# EAGLE design photoduino.shield.v.1.0 (EAGLE 6.1)
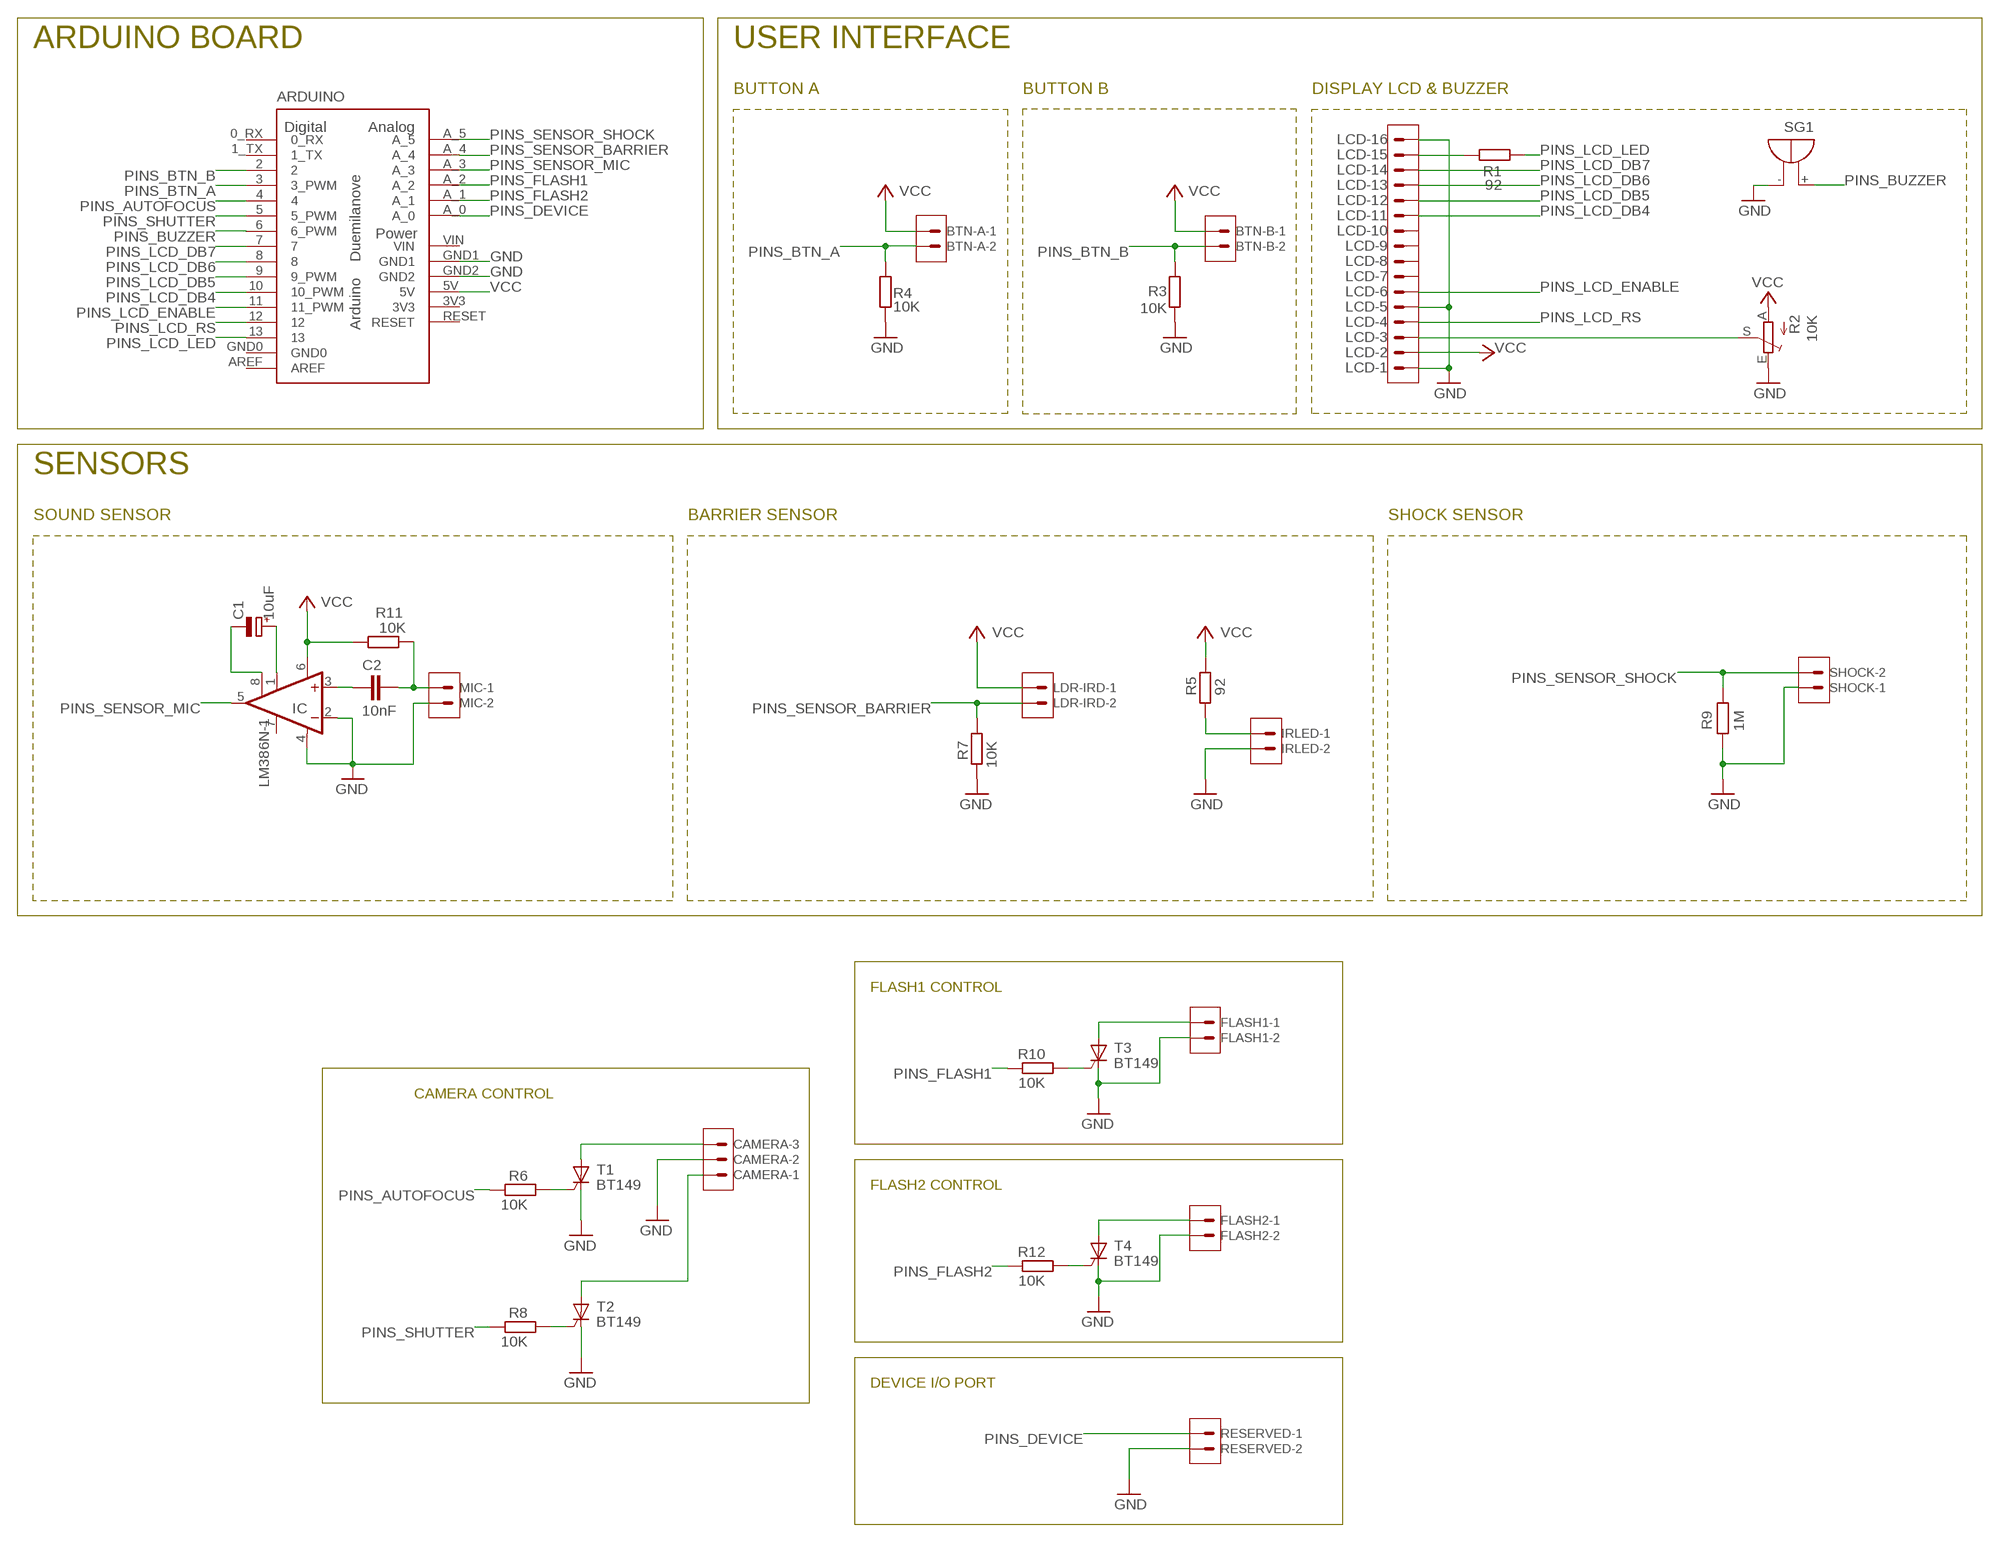
[diagram p0: schematic, sheet 1]

## Parts
ARDUINO  ARDUINO-USBNO-OUTLINE-NO-TEXT-OCTAGONAL  [NO-OUTLINE-OCTAGONAL-NOTEXT]
BTN-A  22-27-2021-02  [6410-02]
BTN-B  22-27-2021-02  [6410-02]
C1  10uF  CPOL-EUE2.5-6  [E2,5-6]
C2  10nF  C-EU050-025X075  [C050-025X075]
CAMERA  22-27-2031-03  [6410-03]
FLASH1  22-27-2021-02  [6410-02]
FLASH2  22-27-2021-02  [6410-02]
IC  LM386N-1  [DIL08]
IRLED  22-27-2021-02  [6410-02]
LCD  HD44780  ML16E  [ML16]
LDR-IRD  22-27-2021-02  [6410-02]
MIC  22-27-2021-02  [6410-02]
R1  92  R-EU_0207/10  [0207/10]
R2  10K  TRIM_EU-RJ9W  [RJ9W]
R3  10K  R-EU_0207/7  [0207/7]
R4  10K  R-EU_0207/7  [0207/7]
R5  92  R-EU_0207/7  [0207/7]
R6  10K  R-EU_0309/V  [0309V]
R7  10K  R-EU_0207/7  [0207/7]
R8  10K  R-EU_0309/V  [0309V]
R9  1M  R-EU_0309/V  [0309V]
R10  10K  R-EU_0309/V  [0309V]
R11  10K  R-EU_0207/7  [0207/7]
R12  10K  R-EU_0309/V  [0309V]
RESERVED  22-27-2021-02  [6410-02]
SG1  F/TMB  [F/TMB]
SHOCK  22-27-2021-02  [6410-02]
T1  BT149  [TO92-4]
T2  BT149  [TO92-4]
T3  BT149  [TO92-4]
T4  BT149  [TO92-4]

## Nets
GND: ARDUINO.GND1 ARDUINO.GND2 CAMERA.2 FLASH1.2 FLASH2.2 IC.2(-IN) IC.4(GND) IRLED.2 LCD.1 LCD.5 LCD.16 MIC.2 R2.E R3.2 R4.1 R7.2 R9.1 RESERVED.2 SG1.- SHOCK.1 T1.C T2.C T3.C T4.C
LCD_CONTRAST: LCD.3 R2.S
N$12: C2.1 IC.3(+IN)
N$16: C2.2 MIC.1 R11.1
N$17: IRLED.1 R5.1
N$18: R10.1 T3.G
N$19: R12.1 T4.G
N$21: CAMERA.3 T1.A
N$23: R6.1 T1.G
N$25: R8.1 T2.G
N$27: C1.+ IC.1(GAIN)
N$29: FLASH2.1 T4.A
N$30: FLASH1.1 T3.A
N$31: C1.- IC.8(GAIN)
N$32: LCD.15 R1.2
PINS_AUTOFOCUS: ARDUINO.4 R6.2
PINS_BTN_A: ARDUINO.3(3_PWM) BTN-A.2 R4.2
PINS_BTN_B: ARDUINO.2 BTN-B.2 R3.1
PINS_BUZZER: ARDUINO.6(6_PWM) SG1.+
PINS_DEVICE: ARDUINO.A_0 RESERVED.1
PINS_FLASH1: ARDUINO.A_2 R10.2
PINS_FLASH2: ARDUINO.A_1 R12.2
PINS_LCD_DB4: ARDUINO.10(10_PWM) LCD.11
PINS_LCD_DB5: ARDUINO.9(9_PWM) LCD.12
PINS_LCD_DB6: ARDUINO.8 LCD.13
PINS_LCD_DB7: ARDUINO.7 LCD.14
PINS_LCD_ENABLE: ARDUINO.11(11_PWM) LCD.6
PINS_LCD_LED: ARDUINO.13 R1.1
PINS_LCD_RS: ARDUINO.12 LCD.4
PINS_SENSOR_BARRIER: ARDUINO.A_4 LDR-IRD.2 R7.1
PINS_SENSOR_MIC: ARDUINO.A_3 IC.5(OUT)
PINS_SENSOR_SHOCK: ARDUINO.A_5 R9.2 SHOCK.2
PINS_SHUTTER: ARDUINO.5(5_PWM) R8.2
SHUTTER: CAMERA.1 T2.A
VCC: ARDUINO.5V BTN-A.1 BTN-B.1 IC.6(VS) LCD.2 LDR-IRD.1 R2.A R5.2 R11.2
Unconnected: ARDUINO.0_RX ARDUINO.1_TX ARDUINO.AREF ARDUINO.GND0 ARDUINO.RESET IC.7(BYPASS) LCD.7 LCD.8 LCD.9 LCD.10

## Notes on the sheet
- ARDUINO BOARD | USER INTERFACE
- BUTTON A | BUTTON B | DISPLAY LCD & BUZZER
- SENSORS
- SOUND SENSOR | BARRIER SENSOR | SHOCK SENSOR
- FLASH1 CONTROL
- CAMERA CONTROL
- FLASH2 CONTROL
- DEVICE I/O PORT

## Power pins joined to a net without a drawn wire
3V3: ARDUINO.3V3
VIN: ARDUINO.VIN

## Library data of the parts
ARDUINO = Arduino-Various:ARDUINO-USB: The Ardiuno Duemilanove Pinouts layoutet as a Bare Shield. v0.5 Also for Arduino Diecimila. This is designed as a Part and has no Outline in the Dimension Layer. The Outline, when present, is drawed at the tPlace / bPlace Layer. Library by Stephanie Lange, http://www.k-ita.de/~sl/
BTN-A BTN-B FLASH1 FLASH2 IRLED LDR-IRD MIC RESERVED SHOCK = con-molex:22-?-02: CONNECTOR wire to board 2.54 mm (.1 inch) pitch header
C1 = resistor:CPOL-EU: POLARIZED CAPACITOR, European symbol
C2 = resistor:C-EU: CAPACITOR, European symbol
CAMERA = con-molex:22-?-03: CONNECTOR wire to board 2.54 mm (.1 inch) pitch header
IC = linear:LM386?-*: Low Voltage Audio Power Amplifier Source: http://cache.national.com/ds/LM/LM386.pdf
LCD = con-ml:ML16E: HARTING
R1 R3-R12 = resistor:R-EU_: RESISTOR, European symbol
R2 = pot:TRIM_EU-: POTENTIOMETER
SG1 = buzzer:F/TMB: BUZZER Source: Buerklin
T1-T4 = triac:BT149: THYRISTOR

## Board
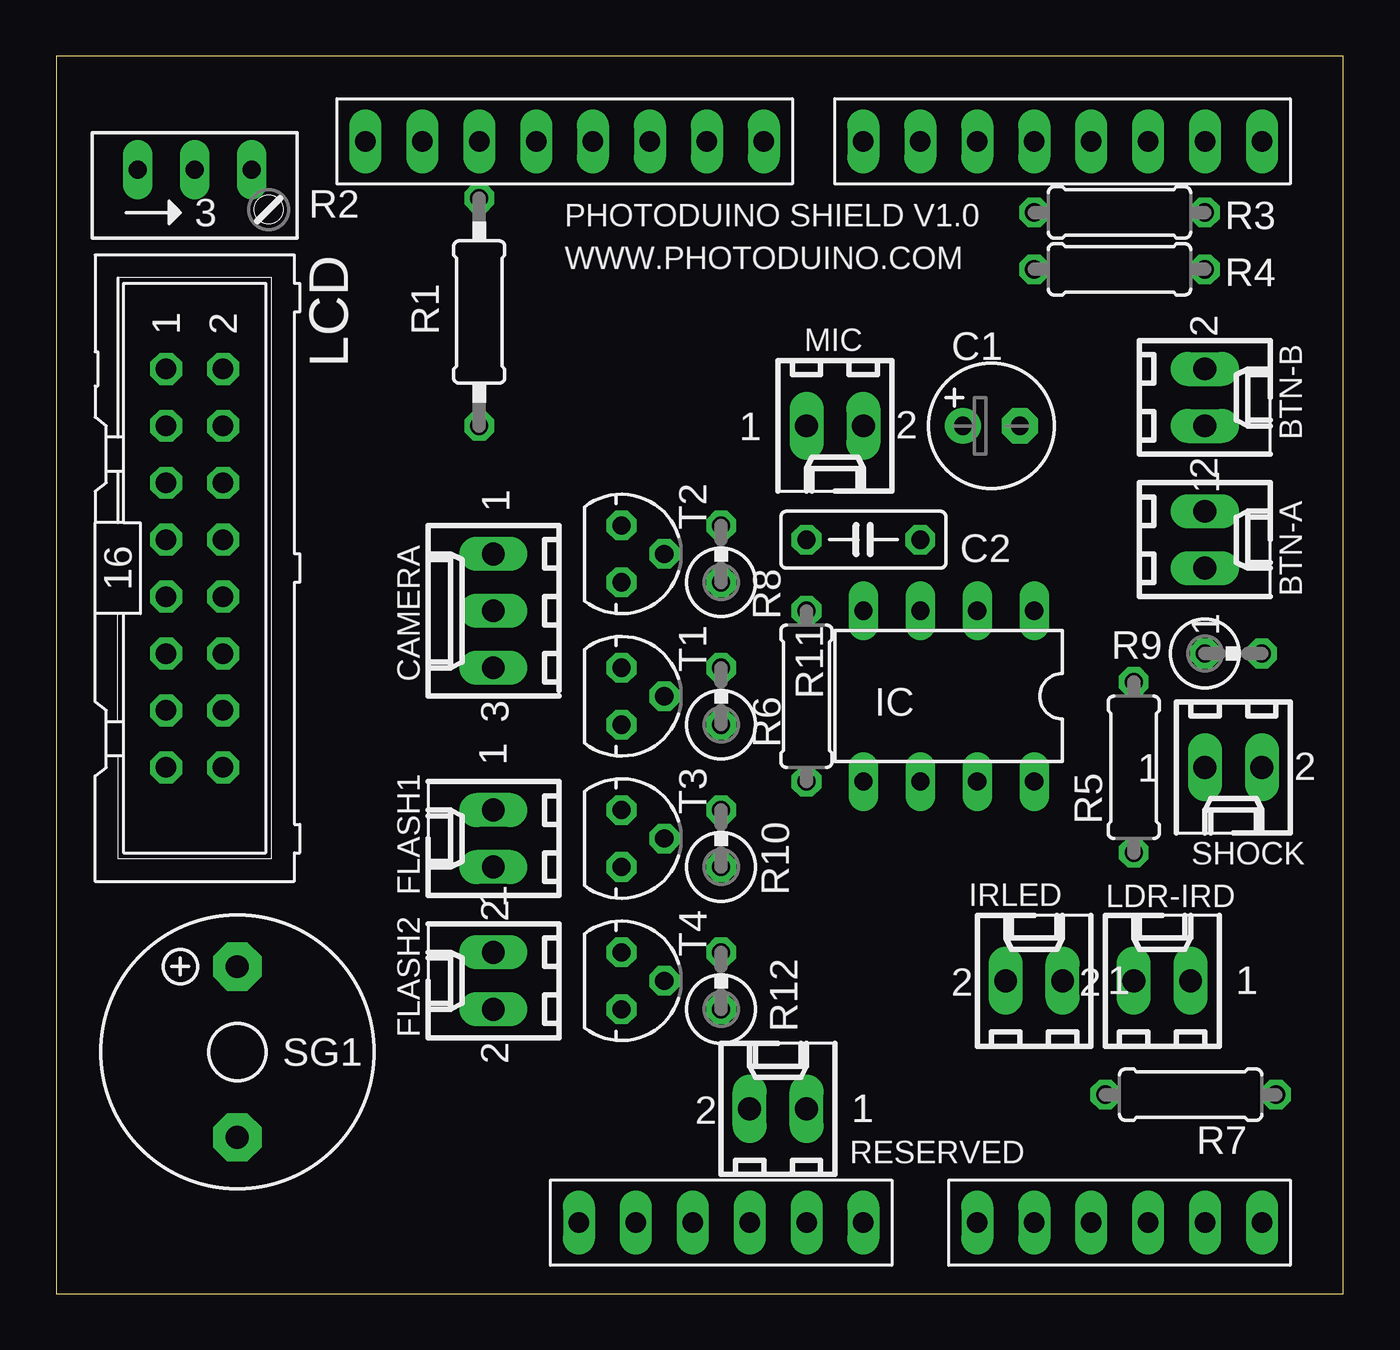
[diagram p1: board, top side]
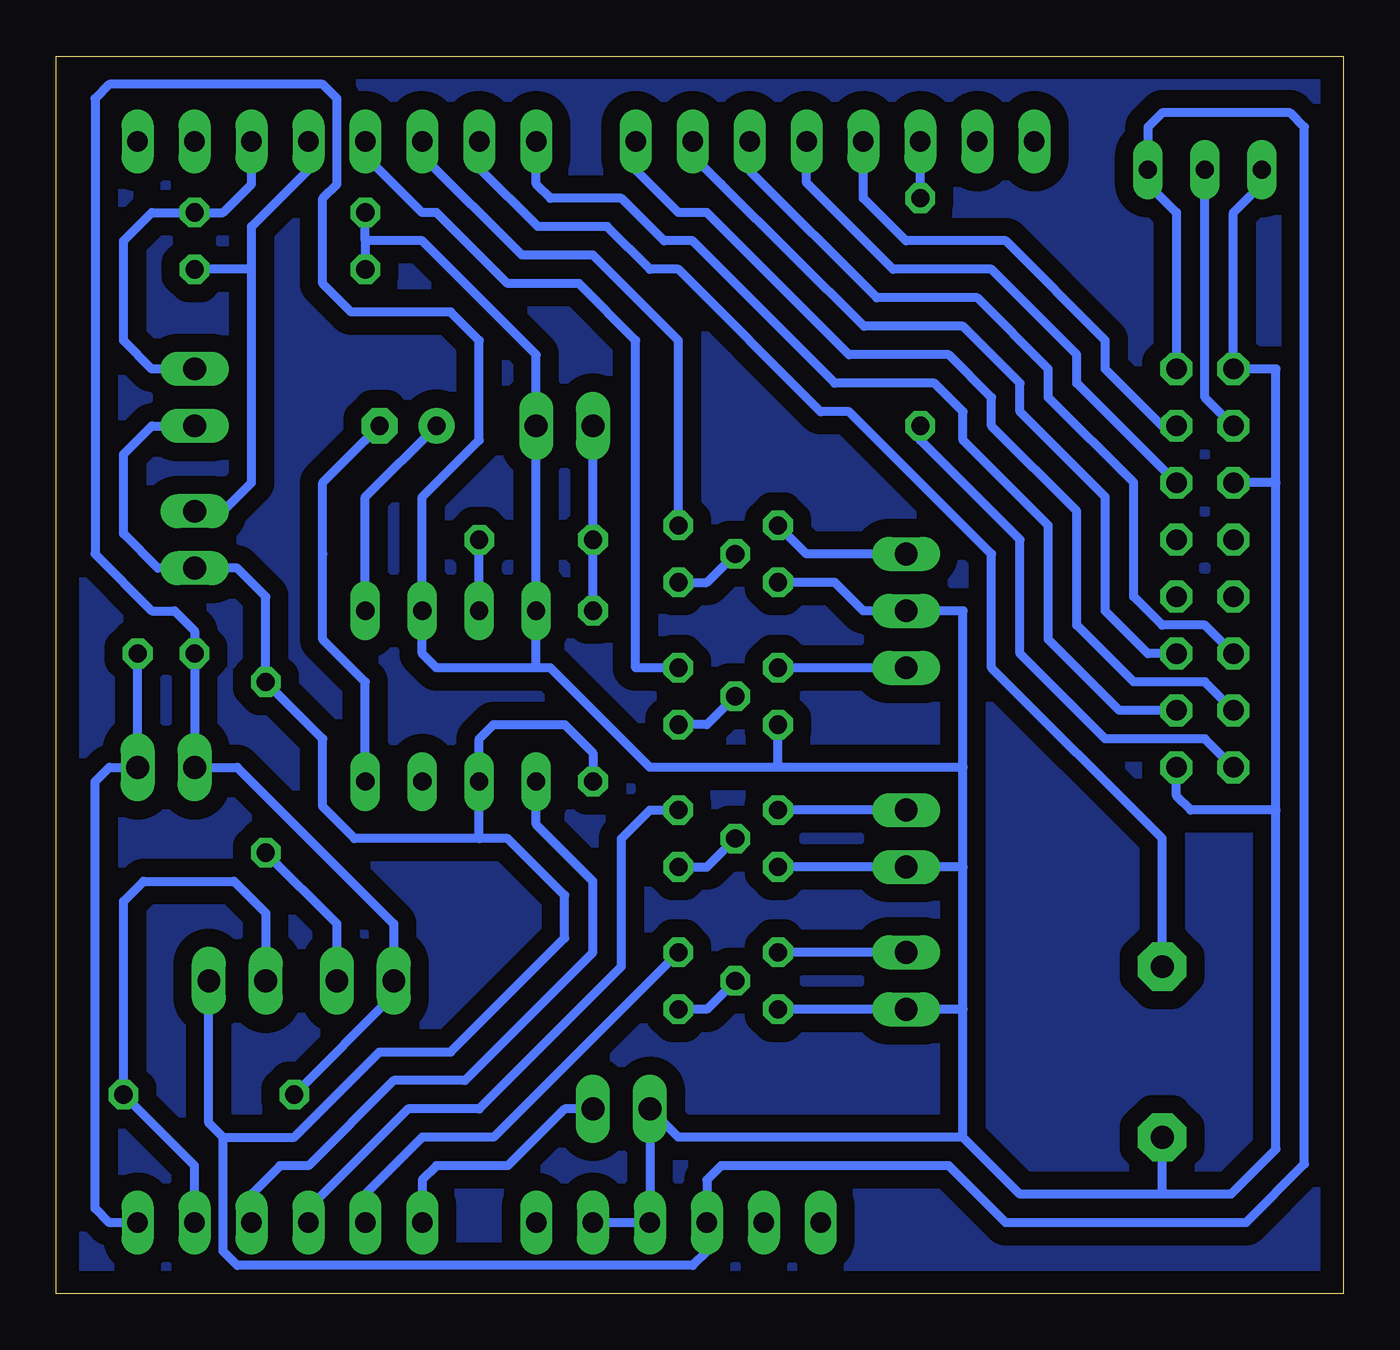
[diagram p2: board, bottom side, seen from below]

Size 57.45 x 55.23 mm. Coordinates in mm from the lower left corner, seen from the top.
Outline: 0,0 57.45,0 57.45,55.23 0,55.23 0,0
Copper layers (1*16): Top 0.035mm / dielectric 1.5mm / Bottom 0.035mm
Design rules: minimum track width 10mil, minimum drill 24mil, track to track 8mil, track to pad 8mil, pad to pad 8mil, via to via 8mil, smd to smd 8mil, copper to edge 40mil, drill to drill 8mil, minimum pad ring 10mil, minimum via ring 8mil, stop-mask expansion 4mil, vias tented up to drill 0mil, thermal gap 10mil

### Footprints (pad centres in the part's own frame; a part is rotated, then mirrored left to right if it is on the bottom)
NO-OUTLINE-OCTAGONAL-NOTEXT = drill 0.914 pad 1.27 long: 0_RX -25.4,27.94; 1_TX -25.4,25.4; 2 -25.4,22.86; 3 -25.4,20.32; 3V3 22.86,0; 4 -25.4,17.78; 5 -25.4,15.24; 5V 22.86,2.54; 6 -25.4,12.7; 7 -25.4,10.16; 8 -25.4,5.715; 9 -25.4,3.175; 10 -25.4,0.635; 11 -25.4,-1.905; 12 -25.4,-4.445; 13 -25.4,-6.985; A_0 22.86,15.24; A_1 22.86,17.78; A_2 22.86,20.32; A_3 22.86,22.86; A_4 22.86,25.4; A_5 22.86,27.94; AREF -25.4,-12.065; GND0 -25.4,-9.525; GND1 22.86,7.62; GND2 22.86,5.08; RESET 22.86,-2.54; VIN 22.86,10.16
6410-02 = drill 1.016 long: 1 1.27,0; 2 -1.27,0
E2,5-6 = drill 0.813 pad 1.6: + -1.27,0 | drill 0.813 pad 1.6 octagon: - 1.27,0
C050-025X075 = drill 0.813 octagon: 1 -2.54,0; 2 2.54,0
6410-03 = drill 1.016 long: 1 2.54,0; 2 0,0; 3 -2.54,0
DIL08 = drill 0.813 long: 1 -3.81,-3.81; 2 -1.27,-3.81; 3 1.27,-3.81; 4 3.81,-3.81; 5 3.81,3.81; 6 1.27,3.81; 7 -1.27,3.81; 8 -3.81,3.81
ML16 = drill 0.914 octagon: 1 -8.89,-1.27; 2 -8.89,1.27; 3 -6.35,-1.27; 4 -6.35,1.27; 5 -3.81,-1.27; 6 -3.81,1.27; 7 -1.27,-1.27; 8 -1.27,1.27; 9 1.27,-1.27; 10 1.27,1.27; 11 3.81,-1.27; 12 3.81,1.27; 13 6.35,-1.27; 14 6.35,1.27; 15 8.89,-1.27; 16 8.89,1.27
0207/10 = drill 0.813 octagon: 1 -5.08,0; 2 5.08,0
RJ9W = drill 0.813 long: A 2.54,0.635; E -2.54,0.635; S 0,0.635
0207/7 = drill 0.813 octagon: 1 -3.81,0; 2 3.81,0
0309V = drill 0.813 octagon: 1 -1.27,0; 2 1.27,0
F/TMB = drill 1.016 pad 2.159 octagon: + 3.81,0; - -3.81,0
TO92-4 = drill 0.813 octagon: A -1.27,0; C 1.27,0; G 0,1.905

### Placement (x,y rotation side)
ARDUINO  25.87,26.03 270 top
BTN-A  51.27,33.65 270 top
BTN-B  51.27,40 270 top
C1  41.74,38.73 0 top
C2  36.03,33.65 180 top
CAMERA  19.52,30.48 90 top
FLASH1  19.52,20.32 90 top
FLASH2  19.52,13.96 90 top
IC  39.84,26.67 180 top
IRLED  43.65,13.96 0 top
LCD  6.18,32.38 270 top
LDR-IRD  49.37,13.96 0 top
MIC  34.76,38.73 180 top
R1  18.89,43.81 270 top
R2  6.18,49.52 0 top
R3  47.46,48.25 180 top
R4  47.46,45.71 0 top
R5  48.09,23.49 90 top
R6  29.68,26.67 90 top
R7  50.63,8.88 180 top
R8  29.68,33.02 90 top
R9  52.54,28.57 0 top
R10  29.68,20.32 90 top
R11  33.49,26.67 270 top
R12  29.68,13.96 90 top
RESERVED  32.22,8.25 0 top
SG1  8.09,10.79 90 top
SHOCK  52.54,23.49 180 top
T1  25.23,26.67 270 top
T2  25.23,33.02 270 top
T3  25.23,20.32 270 top
T4  25.23,13.96 270 top

### Tracks (layer width: path | path; a pad name or v marks a point on that pad's centre or on a via)
GND
  Bottom 0.406: FLASH2.2 T4.C FLASH2.2 | 16.98,12.69 16.98,19.05 | 16.98,12.69 FLASH2.2 | 16.98,6.98 16.98,12.69 | 16.98,6.98 29.68,6.98 RESERVED.2 ARDUINO.GND2 ARDUINO.GND1 | 16.98,19.05 16.98,23.49 | 43.65,46.98 R3.2 | 43.65,46.98 R4.1 | R2.E 3.65,49.52 4.92,48.25 LCD.1 3.01,41.27 3.01,36.19 | 3.01,36.19 LCD.5 | 3.01,21.59 3.01,36.19 | 3.01,21.59 6.82,21.59 7.46,22.22 LCD.16 | 8.09,4.44 14.44,4.44 16.98,6.98 | 8.09,4.44 5.02,4.44 3.01,6.45 3.01,21.59 | 43.65,46.98 41.11,46.98 36.03,41.9 MIC.2 IC.4 36.03,27.94 | 8.09,4.44 SG1.- | T2.C 22.7,31.75 21.43,30.48 CAMERA.2 16.98,30.48 16.98,23.49 | 36.03,27.94 35.4,27.94 30.95,23.49 25.23,23.49 | 36.03,27.94 40.48,27.94 41.11,28.57 | 41.11,28.57 IC.2 | R7.2 42.38,13.33 IRLED.2 42.38,16.51 49.37,23.49 SHOCK.1 R9.1 51.27,29.58 52.17,30.48 53.18,30.48 55.72,33.02 55.72,53.34 55.08,53.97 45.55,53.97 44.92,53.34 44.92,49.52 45.55,48.89 45.55,45.08 44.29,43.81 39.84,43.81 38.57,42.54 38.57,38.09 41.11,35.55 41.11,28.57 | 16.98,23.49 25.23,23.49 | 25.23,23.49 T1.C | T3.C FLASH1.2 16.98,19.05
LCD_CONTRAST
  Bottom 0.406: LCD.3 6.18,40 R2.S
N$12
  Bottom 0.406: IC.3 C2.1
N$16
  Bottom 0.406: R11.1 C2.2 MIC.1
N$17
  Bottom 0.406: IRLED.1 44.92,16.51 R5.1
N$18
  Bottom 0.406: R10.1 28.41,19.05 T3.G
N$19
  Bottom 0.406: R12.1 28.41,12.69 T4.G
N$21
  Bottom 0.406: CAMERA.3 23.33,27.94 T1.A
N$22
  pour Bottom (isolate 0.813): 0.47,-0.01 57.62,-0.01 57.62,55.24 0.47,55.24
N$23
  Bottom 0.406: R6.1 28.41,25.39 T1.G
N$25
  Bottom 0.406: R8.1 28.41,31.75 T2.G
N$27
  Bottom 0.406: IC.1 43.65,35.55 C1.+
N$29
  Bottom 0.406: FLASH2.1 T4.A
N$30
  Bottom 0.406: FLASH1.1 T3.A
N$31
  Bottom 0.406: C1.- 43.65,38.09 45.55,36.19 45.55,33.02 45.55,29.21 43.65,27.3 IC.8
N$32
  Bottom 0.406: LCD.15 6.18,24.76 10.63,24.76 14.44,28.57 14.44,33.65 18.89,38.09 R1.2
PINS_AUTOFOCUS
  Bottom 0.406: R6.2 31.59,27.94 31.59,42.54 34.12,45.08 37.3,45.08 40.48,48.25 41.11,48.25 43.65,50.79 ARDUINO.4
PINS_BTN_A
  Bottom 0.406: 48.73,45.71 48.73,47.62 46.19,50.16 ARDUINO.3 | BTN-A.2 50,34.92 48.73,36.19 48.73,45.71 | 48.73,45.71 R4.2
PINS_BTN_B
  Bottom 0.406: BTN-B.2 53.18,41.27 54.45,42.54 54.45,46.98 53.18,48.25 R3.1 50,48.25 48.73,49.52 ARDUINO.2
PINS_BUZZER
  Bottom 0.406: ARDUINO.6 38.57,50.24 35.95,47.62 32.86,47.62 30.95,45.71 29.68,45.71 23.33,39.36 22.06,39.36 15.71,33.02 15.71,27.94 8.09,20.32 SG1.+
PINS_DEVICE
  Bottom 0.406: RESERVED.1 34.76,8.25 37.3,5.71 40.48,5.71 41.11,5.08 ARDUINO.A_0
PINS_FLASH1
  Bottom 0.406: ARDUINO.A_2 46.19,3.81 41.74,8.25 38.57,8.25 32.22,14.6 32.22,20.32 30.95,21.59 R10.2
PINS_FLASH2
  Bottom 0.406: R12.2 37.94,6.98 41.11,6.98 43.65,4.44 ARDUINO.A_1
PINS_LCD_DB4
  Bottom 0.406: LCD.11 6.18,29.84 8.09,29.84 9.36,31.11 9.36,36.19 13.17,40 13.17,41.27 16.35,44.45 20.82,44.45 26.51,50.12 ARDUINO.10
PINS_LCD_DB5
  Bottom 0.406: LCD.12 8.73,28.57 10.63,30.48 10.63,35.55 14.44,39.36 14.44,40.63 16.98,43.17 21.4,43.17 27.78,49.52 29.05,50.79 ARDUINO.9
PINS_LCD_DB6
  Bottom 0.406: LCD.13 6.18,27.3 9.36,27.3 11.9,29.84 11.9,34.92 15.71,38.73 15.71,40 17.62,41.9 22.06,41.9 28.41,48.25 29.68,48.25 31.59,50.16 ARDUINO.8
PINS_LCD_DB7
  Bottom 0.406: LCD.14 10,26.03 13.17,29.21 13.17,34.28 16.98,38.09 16.98,39.36 18.25,40.63 22.7,40.63 29.05,46.98 30.32,46.98 32.22,48.89 35.4,48.89 36.03,49.52 ARDUINO.7
PINS_LCD_ENABLE
  Bottom 0.406: ARDUINO.11 23.96,49.58 20.1,45.71 15.71,45.71 11.9,41.9 11.9,40.63 LCD.6
PINS_LCD_LED
  Bottom 0.406: R1.1 ARDUINO.13
PINS_LCD_RS
  Bottom 0.406: ARDUINO.12 21.43,48.89 19.52,46.98 15.08,46.98 10.63,42.54 10.63,41.27 8.09,38.73 LCD.4
PINS_SENSOR_BARRIER
  Bottom 0.406: LDR-IRD.2 48.09,16.99 49.52,18.41 53.55,18.41 54.45,17.51 R7.1 51.27,5.71 ARDUINO.A_4
PINS_SENSOR_MIC
  Bottom 0.406: ARDUINO.A_3 48.73,4.44 47.46,5.71 46.19,5.71 42.38,9.52 39.2,9.52 33.49,15.23 33.49,18.41 36.03,20.95 IC.5
PINS_SENSOR_SHOCK
  Bottom 0.406: R9.2 SHOCK.2 55.08,23.49 55.72,22.86 55.72,3.81 55.08,3.17 ARDUINO.A_5
PINS_SHUTTER
  Bottom 0.406: R8.2 29.68,42.54 33.49,46.35 36.66,46.35 41.11,50.79 ARDUINO.5
SHUTTER
  Bottom 0.406: CAMERA.1 23.96,33.02 T2.A
VCC
  Bottom 0.406: BTN-B.1 53.18,38.73 54.45,37.46 54.45,33.91 52.91,32.38 BTN-A.1 49.37,32.38 48.09,31.11 R5.2 45.55,24.76 45.55,21.73 44.13,20.32 38.57,20.32 | LCD.2 7.46,48.25 8.73,49.52 R2.A 8.73,52.06 8.09,52.7 2.38,52.7 1.74,52.06 1.74,5.79 4.36,3.17 15.08,3.17 17.62,5.71 27.78,5.71 28.41,5.08 ARDUINO.5V 28.41,1.9 29.05,1.27 49.37,1.27 50,1.9 50,6.98 | R11.2 33.49,24.12 34.76,25.39 37.94,25.39 38.57,24.76 IC.6 38.57,20.32 | LDR-IRD.1 50.63,7.62 50,6.98 | 50,6.98 46.83,6.98 43.02,10.79 39.84,10.79 34.76,15.87 34.76,17.78 37.3,20.32 38.57,20.32

### Text on the board
tNames: PHOTODUINO SHIELD V1.0 | WWW.PHOTODUINO.COM